# EAGLE design PPMB32-E (EAGLE 9.6.1)

## Sheet 1 of 2
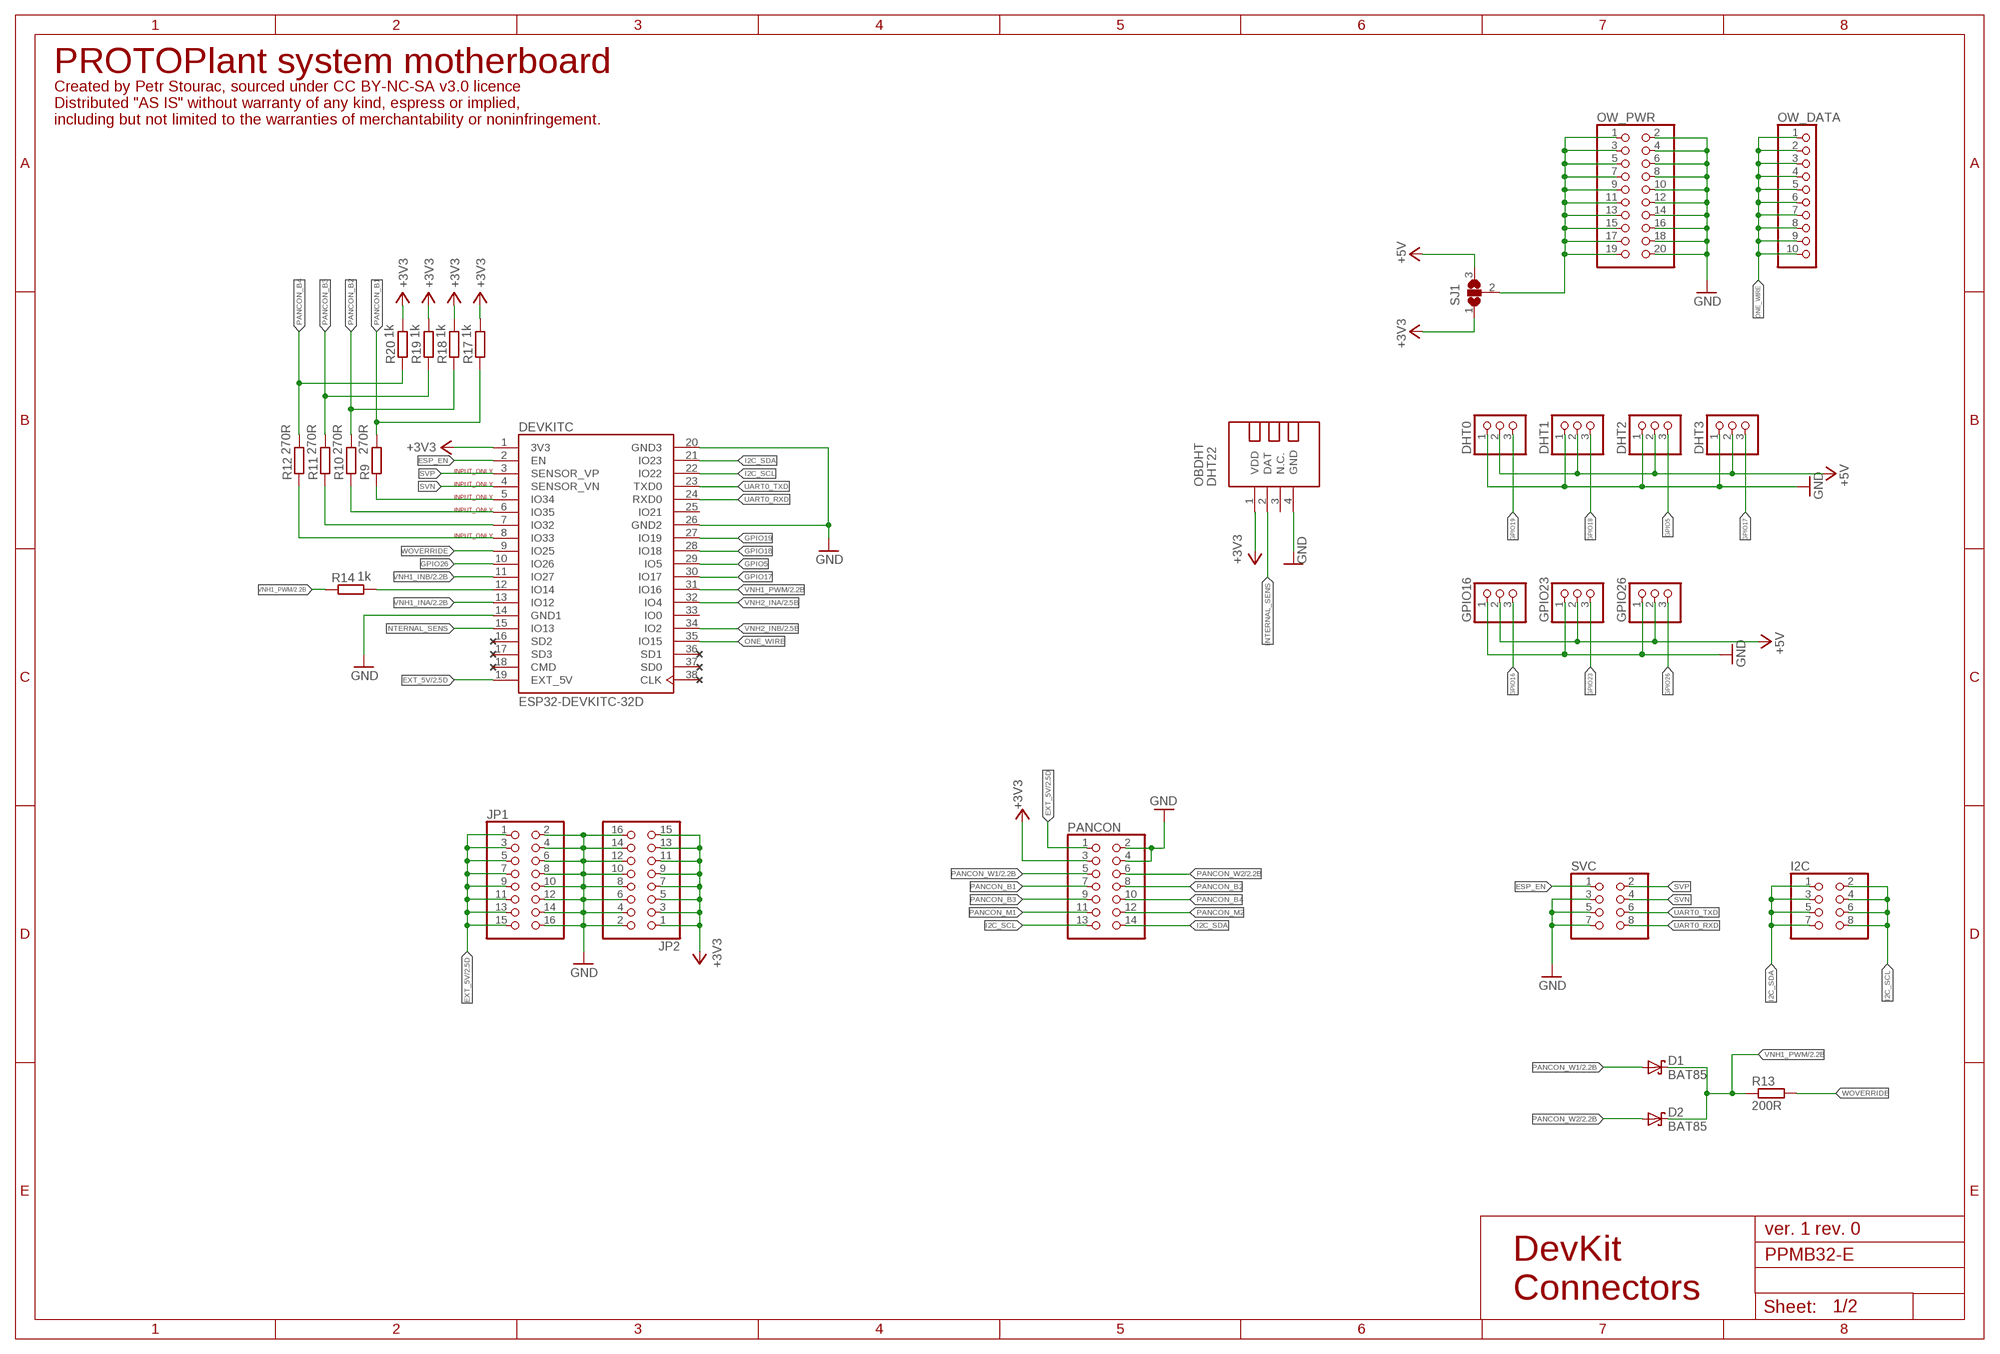
[diagram p0: schematic, sheet 1]

### Parts
D1  BAT85  SCHOTTKY-DIODEDO35-7  [DO35-7]
D2  BAT85  SCHOTTKY-DIODEDO35-7  [DO35-7]
DEVKITC  ESP32-DEVKITC-32D  [MODULE_ESP32-DEVKITC-32D]
DHT0  PINHD-1X3  [1X03]
DHT1  PINHD-1X3  [1X03]
DHT2  PINHD-1X3  [1X03]
DHT3  PINHD-1X3  [1X03]
GPIO16  PINHD-1X3  [1X03]
GPIO23  PINHD-1X3  [1X03]
GPIO26  PINHD-1X3  [1X03]
I2C  PINHD-2X4  [2X04]
JP1  PINHD-2X8  [2X08]
JP2  PINHD-2X8  [2X08]
OBDHT  DHT22  TEMP-HUM-SENSOR-DHT22  [TEMP-HUM-SENSOR-DHT22]
OW_DATA  PINHD-1X10  [1X10]
OW_PWR  PINHD-2X10  [2X10]
PANCON  PINHD-2X7  [2X07]
R9  270R  R-EU_R0603  [R0603]
R10  270R  R-EU_R0603  [R0603]
R11  270R  R-EU_R0603  [R0603]
R12  270R  R-EU_R0603  [R0603]
R13  200R  R-EU_R0603  [R0603]
R14  1k  R-EU_R0603  [R0603]
R17  1k  R-EU_R0603  [R0603]
R18  1k  R-EU_R0603  [R0603]
R19  1k  R-EU_R0603  [R0603]
R20  1k  R-EU_R0603  [R0603]
SJ1  SJ2W  [SJ_2]
SVC  PINHD-2X4  [2X04]

### Nets
+3V3: DEVKITC.1(3V3) JP2.1 JP2.3 JP2.5 JP2.7 JP2.9 JP2.11 JP2.13 JP2.15 OBDHT.1(VDD) PANCON.3 R17.2 R18.2 R19.2 R20.2 SJ1.1 ; also sheet 2
+5V: DHT0.2 DHT1.2 DHT2.2 DHT3.2 GPIO16.2 GPIO23.2 GPIO26.2 SJ1.3
ESP_EN: DEVKITC.2(EN) SVC.1
EXT_5V: DEVKITC.19(EXT_5V) JP1.1 JP1.3 JP1.5 JP1.7 JP1.9 JP1.11 JP1.13 JP1.15 PANCON.1 ; also sheet 2
GND: DEVKITC.14(GND1) DEVKITC.20(GND3) DEVKITC.26(GND2) DHT0.1 DHT1.1 DHT2.1 DHT3.1 GPIO16.1 GPIO23.1 GPIO26.1 JP1.2 JP1.4 JP1.6 JP1.8 JP1.10 JP1.12 JP1.14 JP1.16 JP2.2 JP2.4 JP2.6 JP2.8 JP2.10 JP2.12 JP2.14 JP2.16 OBDHT.4(GND) OW_PWR.2 OW_PWR.4 OW_PWR.6 OW_PWR.8 OW_PWR.10 OW_PWR.12 OW_PWR.14 OW_PWR.16 OW_PWR.18 OW_PWR.20 PANCON.2 PANCON.4 SVC.3 SVC.5 SVC.7 ; also sheet 2
GPIO5: DEVKITC.29(IO5) DHT2.3
GPIO16: GPIO16.3
GPIO17: DEVKITC.30(IO17) DHT3.3
GPIO18: DEVKITC.28(IO18) DHT1.3
GPIO19: DEVKITC.27(IO19) DHT0.3
GPIO23: GPIO23.3
GPIO26: DEVKITC.10(IO26) GPIO26.3
I2C_SCL: DEVKITC.22(IO22) I2C.2 I2C.4 I2C.6 I2C.8 PANCON.13
I2C_SDA: DEVKITC.21(IO23) I2C.1 I2C.3 I2C.5 I2C.7 PANCON.14
INTERNAL_SENS: DEVKITC.15(IO13) OBDHT.2(DAT)
N$4: DEVKITC.5(IO34) R9.1
N$8: DEVKITC.6(IO35) R10.1
N$9: DEVKITC.7(IO32) R11.1
N$10: DEVKITC.8(IO33) R12.1
N$11: OW_PWR.1 OW_PWR.3 OW_PWR.5 OW_PWR.7 OW_PWR.9 OW_PWR.11 OW_PWR.13 OW_PWR.15 OW_PWR.17 OW_PWR.19 SJ1.2
N$12: DEVKITC.12(IO14) R14.2
ONE_WIRE: DEVKITC.35(IO15) OW_DATA.1 OW_DATA.2 OW_DATA.3 OW_DATA.4 OW_DATA.5 OW_DATA.6 OW_DATA.7 OW_DATA.8 OW_DATA.9 OW_DATA.10
PANCON_B1: PANCON.7 R9.2 R17.1
PANCON_B2: PANCON.8 R10.2 R18.1
PANCON_B3: PANCON.9 R11.2 R19.1
PANCON_B4: PANCON.10 R12.2 R20.1
PANCON_M1: PANCON.11
PANCON_M2: PANCON.12
PANCON_W1: D1.A PANCON.5 ; also sheet 2
PANCON_W2: D2.A PANCON.6 ; also sheet 2
SVN: DEVKITC.4(SENSOR_VN) SVC.4
SVP: DEVKITC.3(SENSOR_VP) SVC.2
UART0_RXD: DEVKITC.24(RXD0) SVC.8
UART0_TXD: DEVKITC.23(TXD0) SVC.6
VNH1_INA: DEVKITC.13(IO12) ; also sheet 2
VNH1_INB: DEVKITC.11(IO27) ; also sheet 2
VNH1_PWM: D1.C D2.C DEVKITC.31(IO16) R13.1 R14.1 ; also sheet 2
VNH2_INA: DEVKITC.32(IO4) ; also sheet 2
VNH2_INB: DEVKITC.34(IO2) ; also sheet 2
WOVERRIDE: DEVKITC.9(IO25) R13.2
Unconnected: DEVKITC.16(SD2) DEVKITC.17(SD3) DEVKITC.18(CMD) DEVKITC.25(IO21) DEVKITC.33(IO0) DEVKITC.36(SD1) DEVKITC.37(SD0) DEVKITC.38(CLK) OBDHT.3(N.C.)

### Notes on the sheet
- PROTOPlant system motherboard
- Created by Petr Stourac, sourced under CC BY-NC-SA v3.0 licence
  Distributed "AS IS" without warranty of any kind, espress or implied, 
  including but not limited to the warranties of merchantability or noninfringement.
- INPUT_ONLY
- INPUT_ONLY
- INPUT_ONLY
- INPUT_ONLY
- INPUT_ONLY
- ver. 1 rev. 0
- DevKit
  Connectors

## Sheet 2 of 2
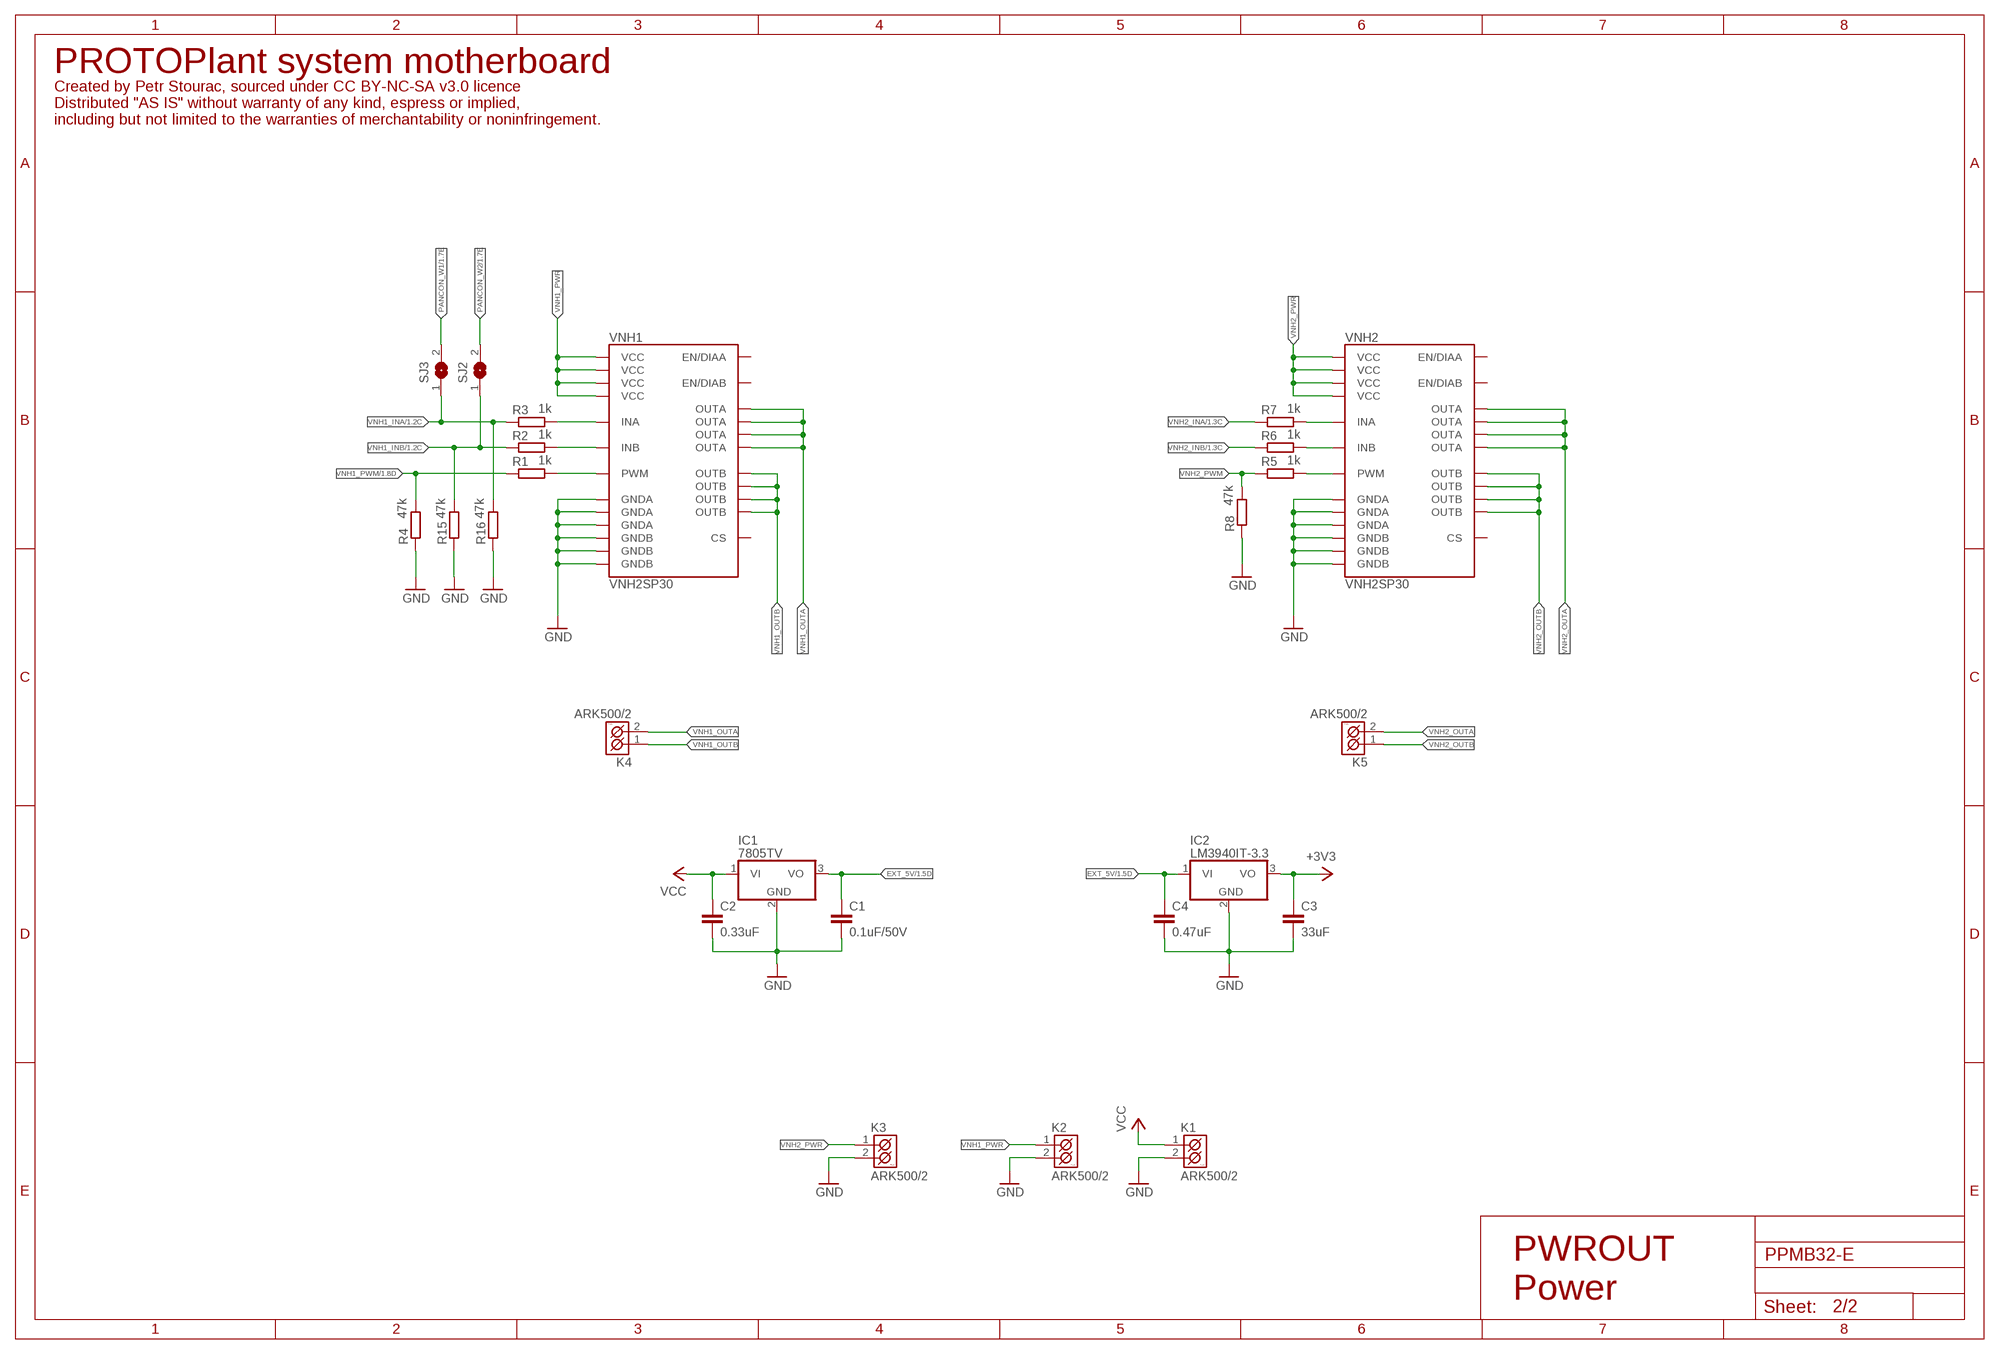
[diagram p1: schematic, sheet 2]

### Parts
C1  0.1uF/50V  C-EUC1206K  [C1206K]
C2  0.33uF  C-EUC1206K  [C1206K]
C3  33uF  C-EUC1206K  [C1206K]
C4  0.47uF  C-EUC1206K  [C1206K]
IC1  7805TV  [TO220V]
IC2  LM3940IT-3.3  788TV  [TO220V]
K1  ARK500/2  [ARK500/2]
K2  ARK500/2  [ARK500/2]
K3  ARK500/2  [ARK500/2]
K4  ARK500/2  [ARK500/2]
K5  ARK500/2  [ARK500/2]
R1  1k  R-EU_R0603  [R0603]
R2  1k  R-EU_R0603  [R0603]
R3  1k  R-EU_R0603  [R0603]
R4  47k  R-EU_R0603  [R0603]
R5  1k  R-EU_R0603  [R0603]
R6  1k  R-EU_R0603  [R0603]
R7  1k  R-EU_R0603  [R0603]
R8  47k  R-EU_R0603  [R0603]
R15  47k  R-EU_R0603  [R0603]
R16  47k  R-EU_R0603  [R0603]
SJ2  SJ  [SJ]
SJ3  SJ  [SJ]
VNH1  VNH2SP30  [VNH2SP30]
VNH2  VNH2SP30  [VNH2SP30]

### Nets
+3V3: C3.1 IC2.3(VO) ; also sheet 1
EXT_5V: C1.1 C4.1 IC1.3(VO) IC2.1(VI) ; also sheet 1
GND: C1.2 C2.2 C3.2 C4.2 IC1.2(GND) IC2.2(GND) K1.2(K2) K2.2(K2) K3.2(K2) R4.1 R8.1 R15.1 R16.1 VNH1.18(GNDB) VNH1.19(GNDB) VNH1.20(GNDB) VNH1.26(GNDA) VNH1.27(GNDA) VNH1.28(GNDA) VNH2.18(GNDB) VNH2.19(GNDB) VNH2.20(GNDB) VNH2.26(GNDA) VNH2.27(GNDA) VNH2.28(GNDA) ; also sheet 1
N$1: R3.2 VNH1.5(INA)
N$2: R2.2 VNH1.11(INB)
N$3: R1.2 VNH1.8(PWM)
N$5: R5.2 VNH2.8(PWM)
N$6: R6.2 VNH2.11(INB)
N$7: R7.2 VNH2.5(INA)
PANCON_W1: SJ3.2 ; also sheet 1
PANCON_W2: SJ2.2 ; also sheet 1
VCC: C2.1 IC1.1(VI) K1.1(K1)
VNH1_INA: R3.1 R16.2 SJ3.1 ; also sheet 1
VNH1_INB: R2.1 R15.2 SJ2.1 ; also sheet 1
VNH1_OUTA: K4.2(K2) VNH1.1(OUTA) VNH1.25(OUTA) VNH1.30(OUTA) VNH1.SLUG3(OUTA)
VNH1_OUTB: K4.1(K1) VNH1.15(OUTB) VNH1.16(OUTB) VNH1.21(OUTB) VNH1.SLUG2(OUTB)
VNH1_PWM: R1.1 R4.2 ; also sheet 1
VNH1_PWR: K2.1(K1) VNH1.3(VCC) VNH1.13(VCC) VNH1.23(VCC) VNH1.SLUG1(VCC)
VNH2_INA: R7.1 ; also sheet 1
VNH2_INB: R6.1 ; also sheet 1
VNH2_OUTA: K5.2(K2) VNH2.1(OUTA) VNH2.25(OUTA) VNH2.30(OUTA) VNH2.SLUG3(OUTA)
VNH2_OUTB: K5.1(K1) VNH2.15(OUTB) VNH2.16(OUTB) VNH2.21(OUTB) VNH2.SLUG2(OUTB)
VNH2_PWM: R5.1 R8.2
VNH2_PWR: K3.1(K1) VNH2.3(VCC) VNH2.13(VCC) VNH2.23(VCC) VNH2.SLUG1(VCC)
Unconnected: VNH1.6(EN/DIAA) VNH1.9(CS) VNH1.10(EN/DIAB) VNH2.6(EN/DIAA) VNH2.9(CS) VNH2.10(EN/DIAB)

### Notes on the sheet
- PROTOPlant system motherboard
- Created by Petr Stourac, sourced under CC BY-NC-SA v3.0 licence
  Distributed "AS IS" without warranty of any kind, espress or implied, 
  including but not limited to the warranties of merchantability or noninfringement.
- PWROUT
  Power

## Library data of the parts
C1-C4 = rcl:C-EU: CAPACITOR, European symbol; SPICEPREFIX: C
D1 D2 = adafruit:SCHOTTKY-DIODE: Schottky Diode
DEVKITC = ESP32-DEVKITC-32D:ESP32-DEVKITC-32D: Eval Board For Esp-Wroom-32; AVAILABILITY: Unavailable; DESCRIPTION: Eval Board For Esp-Wroom-32; MF: Espressif Systems; MP: ESP32-DEVKITC-32D; PACKAGE: None; PRICE: None
DHT0 DHT1-DHT3 GPIO16 GPIO23 GPIO26 = pinhead:PINHD-1X3: PIN HEADER
I2C SVC = pinhead:PINHD-2X4: PIN HEADER
IC1 IC2 = linear:78*: Positive VOLTAGE REGULATOR Source: http://cache.national.com/ds/LM/LM78L05.pdf http://www.fairchildsemi.com/ds/LM/LM7805.pdf
JP1 JP2 = pinhead:PINHD-2X8: PIN HEADER
K1-K5 = #PaJa_konektory:ARK500/2: Svorkovnice - roztec 5mm - dvojita
OBDHT = diy-modules:TEMP-HUM-SENSOR-DHT22: DHT22 - digital humidity & temperature sensor Also known as: AM2302 AM2302 datasheet available here: http://akizukidenshi.com/download/ds/aosong/AM2302.pdf Click here to find device on ebay.com <http://www.ebay.com/sch/dht22+digital+sensor>
OW_DATA = pinhead:PINHD-1X10: PIN HEADER
OW_PWR = pinhead:PINHD-2X10: PIN HEADER
PANCON = pinhead:PINHD-2X7: PIN HEADER
R1-R20 = rcl:R-EU_: RESISTOR, European symbol; SPICEPREFIX: R
SJ1 = jumper:SJ2W: SMD solder JUMPER
SJ2 SJ3 = jumper:SJ: SMD solder JUMPER
VNH1 VNH2 = SparkFun-IC-Special-Function:VNH2SP30: 30A motor driver IC(IC-10030,moster moto)

## Board
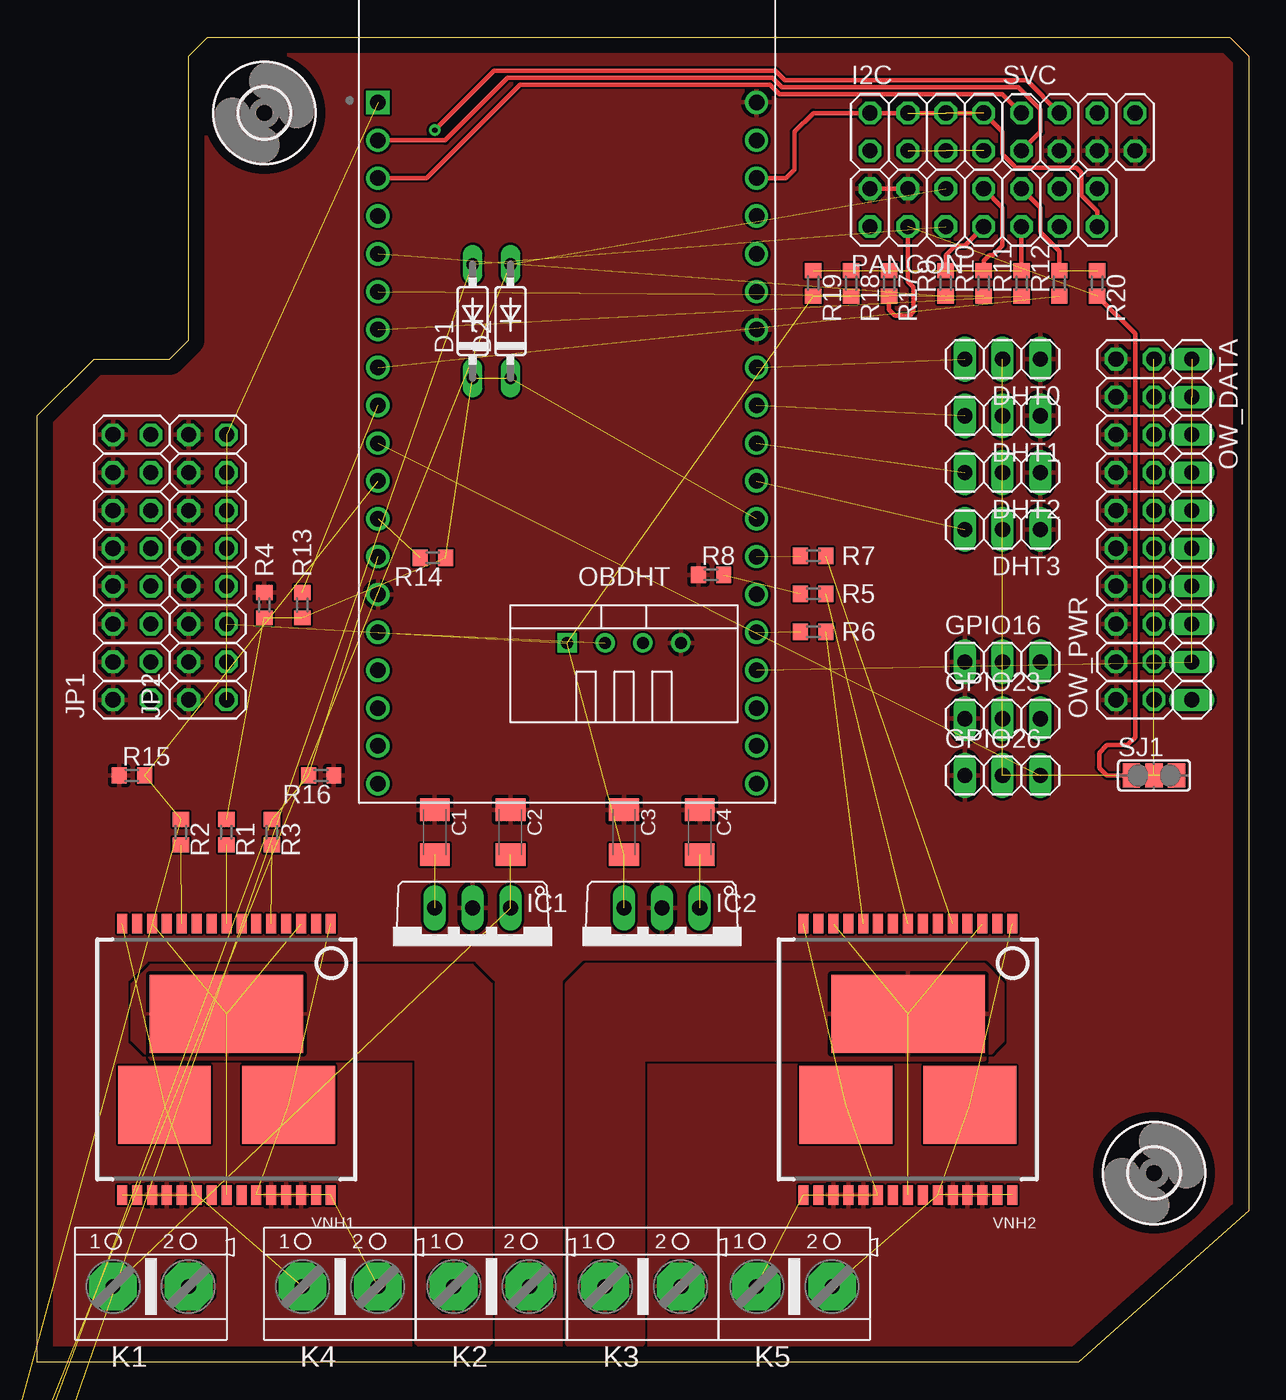
[diagram p2: board, top side]
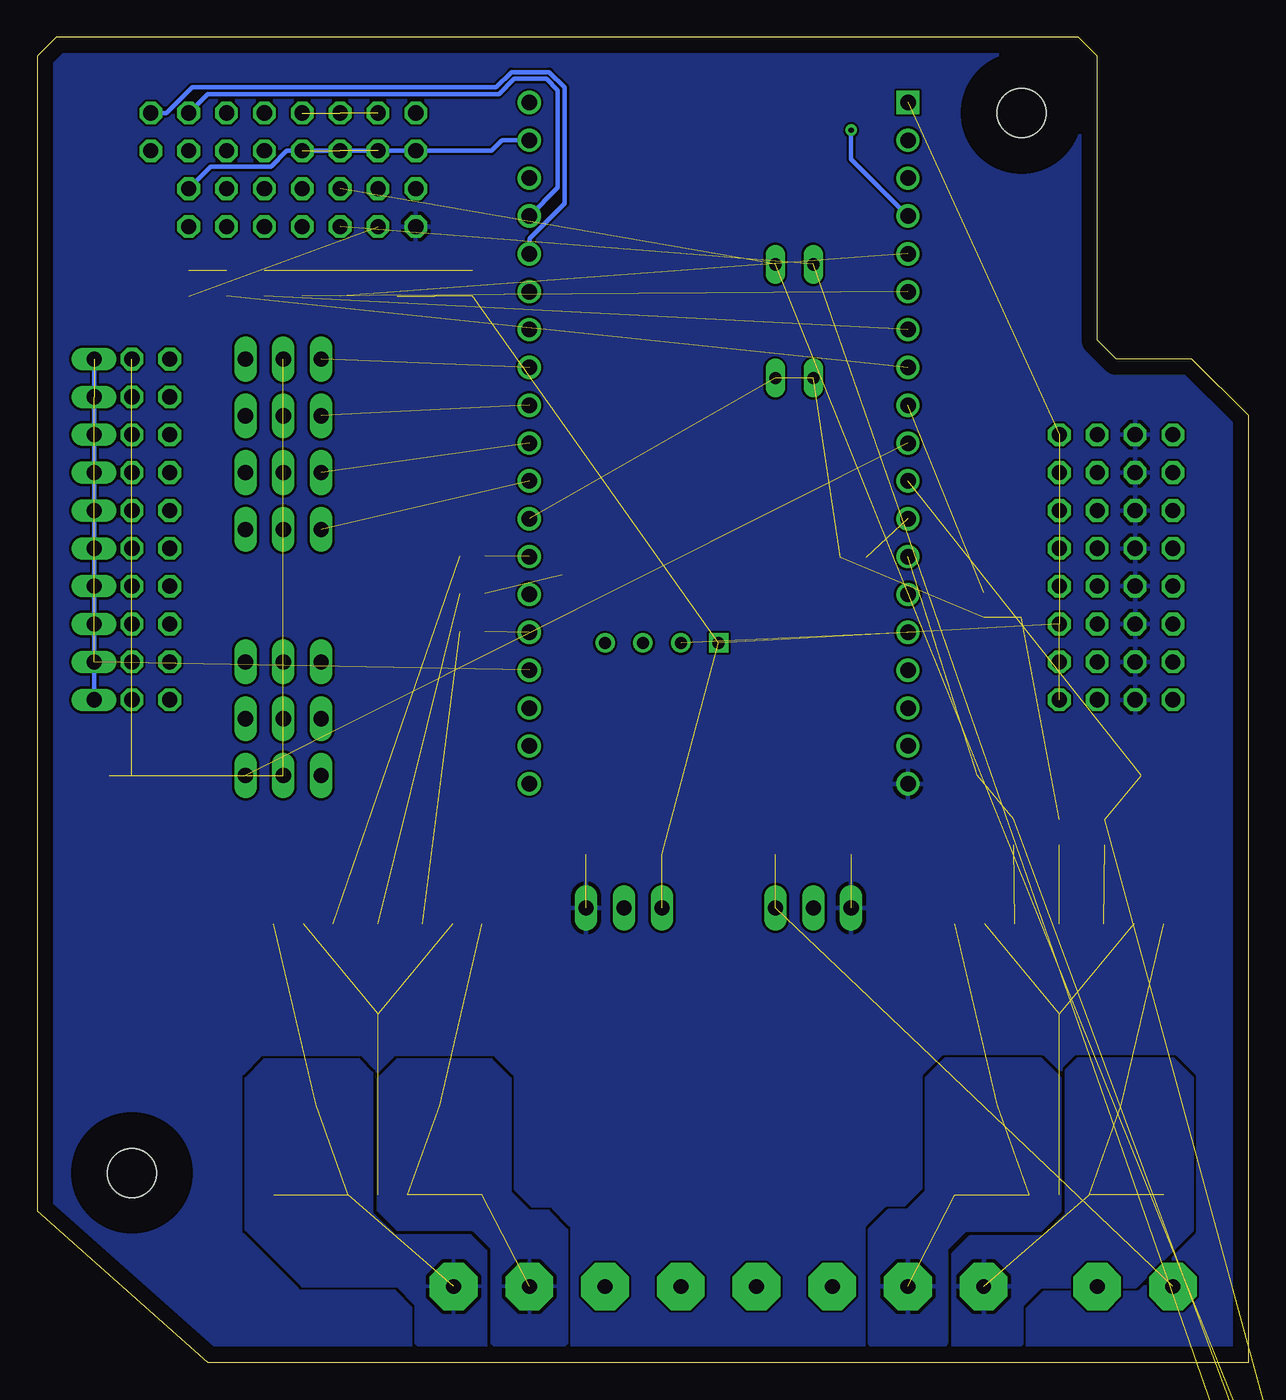
[diagram p3: board, bottom side, seen from below]

Size 81.28 x 88.9 mm. Coordinates in mm from the lower left corner, seen from the top.
Outline: 0,0 0,63.5 3.81,67.31 8.89,67.31 10.16,68.58 10.16,87.63 11.43,88.9 80.01,88.9 81.28,87.63 81.28,10.16 69.85,0 0,0
Copper layers (1*16): Top 0.035mm / dielectric 1.5mm / Bottom 0.035mm
Design rules "default *": minimum track width 12mil, minimum drill 0.35mm, track to track 6mil, track to pad 6mil, pad to pad 6mil, via to via 6mil, smd to smd 6mil, copper to edge 40mil, drill to drill 6mil, minimum pad ring 10mil, minimum via ring 8mil, stop-mask expansion 4mil, vias tented up to drill 0mil, thermal gap 10mil

### Footprints (pad centres in the part's own frame; a part is rotated, then mirrored left to right if it is on the bottom)
C1206K = smd 1.5 x 2: 1 -1.5,0; 2 1.5,0
DO35-7 = drill 0.813 long: A 3.81,0; C -3.81,0
MODULE_ESP32-DEVKITC-32D = drill 1.04 square: 1 -12.7,19.76 | drill 1.04: 2 -12.7,17.22; 3 -12.7,14.68; 4 -12.7,12.14; 5 -12.7,9.6; 6 -12.7,7.06; 7 -12.7,4.52; 8 -12.7,1.98; 9 -12.7,-0.56; 10 -12.7,-3.1; 11 -12.7,-5.64; 12 -12.7,-8.18; 13 -12.7,-10.72; 14 -12.7,-13.26; 15 -12.7,-15.8; 16 -12.7,-18.34; 17 -12.7,-20.88; 18 -12.7,-23.42; 19 -12.7,-25.96; 20 12.7,19.76; 21 12.7,17.22; 22 12.7,14.68; 23 12.7,12.14; 24 12.7,9.6; 25 12.7,7.06; 26 12.7,4.52; 27 12.7,1.98; 28 12.7,-0.56; 29 12.7,-3.1; 30 12.7,-5.64; 31 12.7,-8.18; 32 12.7,-10.72; 33 12.7,-13.26; 34 12.7,-15.8; 35 12.7,-18.34; 36 12.7,-20.88; 37 12.7,-23.42; 38 12.7,-25.96
1X03 = drill 1.016 long: 1 -2.54,0; 2 0,0; 3 2.54,0
2X04 = drill 1.016 octagon: 1 -3.81,-1.27; 2 -3.81,1.27; 3 -1.27,-1.27; 4 -1.27,1.27; 5 1.27,-1.27; 6 1.27,1.27; 7 3.81,-1.27; 8 3.81,1.27
TO220V = drill 1.016 long: 1 -2.54,-2.54; 2 0,-2.54; 3 2.54,-2.54
2X08 = drill 1.016 octagon: 1 -8.89,-1.27; 2 -8.89,1.27; 3 -6.35,-1.27; 4 -6.35,1.27; 5 -3.81,-1.27; 6 -3.81,1.27; 7 -1.27,-1.27; 8 -1.27,1.27; 9 1.27,-1.27; 10 1.27,1.27; 11 3.81,-1.27; 12 3.81,1.27; 13 6.35,-1.27; 14 6.35,1.27; 15 8.89,-1.27; 16 8.89,1.27
ARK500/2 = drill 1 pad 3.2 octagon: 1 -2.54,0; 2 2.54,0
TEMP-HUM-SENSOR-DHT22 = drill 0.8 square: 1 -3.81,0 | drill 0.8: 2 -1.27,0; 3 1.27,0; 4 3.81,0
1X10 = drill 1.016 long: 1 -11.43,0; 2 -8.89,0; 3 -6.35,0; 4 -3.81,0; 5 -1.27,0; 6 1.27,0; 7 3.81,0; 8 6.35,0; 9 8.89,0; 10 11.43,0
2X10 = drill 1.016 octagon: 1 -11.43,-1.27; 2 -11.43,1.27; 3 -8.89,-1.27; 4 -8.89,1.27; 5 -6.35,-1.27; 6 -6.35,1.27; 7 -3.81,-1.27; 8 -3.81,1.27; 9 -1.27,-1.27; 10 -1.27,1.27; 11 1.27,-1.27; 12 1.27,1.27; 13 3.81,-1.27; 14 3.81,1.27; 15 6.35,-1.27; 16 6.35,1.27; 17 8.89,-1.27; 18 8.89,1.27; 19 11.43,-1.27; 20 11.43,1.27
2X07 = drill 1.016 octagon: 1 -7.62,-1.27; 2 -7.62,1.27; 3 -5.08,-1.27; 4 -5.08,1.27; 5 -2.54,-1.27; 6 -2.54,1.27; 7 0,-1.27; 8 0,1.27; 9 2.54,-1.27; 10 2.54,1.27; 11 5.08,-1.27; 12 5.08,1.27; 13 7.62,-1.27; 14 7.62,1.27
R0603 = smd 1 x 1.1: 1 -0.85,0; 2 0.85,0
SJ_2 = smd 1.168 x 1.6: 1 -1.524,0; 2 0,0; 3 1.524,0
SJ = smd 1.168 x 1.6: 1 -0.762,0; 2 0.762,0
3,3 = hole 3.3: 0,0
VNH2SP30 = smd 0.67 x 1.3: 1 -7,-9.1; 2 -6,-9.1; 3 -5,-9.1; 4 -4,-9.1; 5 -3,-9.1; 6 -2,-9.1; 7 -1,-9.1; 8 0,-9.1; 9 1,-9.1; 10 2,-9.1; 11 3,-9.1; 12 4,-9.1; 13 5,-9.1; 14 6,-9.1; 15 7,-9.1; 16 7,9.1; 17 6,9.1; 18 5,9.1; 19 4,9.1; 20 3,9.1; 21 2,9.1; 22 1,9.1; 23 0,9.1; 24 -1,9.1; 25 -2,9.1; 26 -3,9.1; 27 -4,9.1; 28 -5,9.1; 29 -6,9.1; 30 -7,9.1 | smd 10.3 x 5.25: SLUG1 0,-3.05 | smd 6.23 x 5.25: SLUG2 4.165,3.05; SLUG3 -4.165,3.05

### Placement (x,y rotation side)
C1  26.67,35.56 90 top
C2  31.75,35.56 90 top
C3  39.37,35.56 90 top
C4  44.45,35.56 90 top
D1  29.21,69.85 90 top
D2  31.75,69.85 90 top
DEVKITC  35.56,64.77 0 top
DHT0  64.77,67.31 180 top
DHT1  64.77,63.5 180 top
DHT2  64.77,59.69 180 top
DHT3  64.77,55.88 180 top
GPIO16  64.77,46.99 0 top
GPIO23  64.77,43.18 0 top
GPIO26  64.77,39.37 0 top
I2C  59.69,82.55 0 top
IC1  29.21,27.94 180 top
IC2  41.91,27.94 180 top
JP1  6.35,53.34 90 top
JP2  11.43,53.34 90 top
K1  7.62,5.08 0 top
K2  30.48,5.08 0 top
K3  40.64,5.08 0 top
K4  20.32,5.08 0 top
K5  50.8,5.08 0 top
OBDHT  39.37,48.26 0 top
OW_DATA  77.47,55.88 270 top
OW_PWR  73.66,55.88 90 top
PANCON  63.5,77.47 0 top
R1  12.7,35.56 270 top
R2  9.65,35.56 270 top
R3  15.75,35.56 270 top
R4  15.24,50.8 270 top
R5  52.07,51.56 0 top
R6  52.07,49.02 0 top
R7  52.07,54.1 0 top
R8  45.21,52.83 0 top
R9  60.96,72.39 90 top
R10  63.5,72.39 90 top
R11  66.04,72.39 90 top
R12  68.58,72.39 90 top
R13  17.78,50.8 90 top
R14  26.54,53.98 180 top
R15  6.35,39.37 0 top
R16  19.05,39.37 180 top
R17  57.15,72.39 270 top
R18  54.61,72.39 270 top
R19  52.07,72.39 270 top
R20  71.12,72.39 270 top
SJ1  74.93,39.37 0 top
SJ2  -1.27,-6.35 0 top  (outside the outline)
SJ3  -1.27,-11.43 0 top  (outside the outline)
SVC  69.85,82.55 0 top
U$7  [3,3]  15.24,83.82 0 top
U$8  [3,3]  74.93,12.7 0 top
VNH1  12.7,20.32 180 top
VNH2  58.42,20.32 180 top

### Tracks (layer width: path | path; a pad name or v marks a point on that pad's centre or on a via)
+3V3  (15 unrouted)
  Top 0.305: R17.2 57.15,70.61 57.53,70.23 58.55,70.23 58.8,70.48 58.8,72.14 58.42,72.52 PANCON.3 | R20.2 73.66,69 73.66,41.91 73.15,41.4 71.75,41.4 71.25,40.89 71.25,39.88 71.75,39.37 SJ1.1
+5V  (7 unrouted)
ESP_EN
  Top 0.305: SVC.1 67.31,82.55 67.31,84.06 65.82,85.55 49.97,85.55 49.34,86.18 46.99,86.18 46.86,86.18 31.57,86.18 27.38,81.99 DEVKITC.2
EXT_5V  (2 unrouted)
  pour Bottom (rank 6): -3.81,90.17 83.82,90.17 83.82,-2.54 -3.81,-2.54
GND
  Top 0.305: PANCON.4 PANCON.2
  pour Top (rank 3): 45.72,1.27 44.45,0 26.67,0 25.4,1.27 25.4,8.89 24.13,10.16 3.81,10.16 2.54,11.43 2.54,29.21 3.81,30.48 21.59,30.48 22.86,29.21 48.26,29.21 49.53,30.48 67.31,30.48 68.58,29.21 68.58,11.43 67.31,10.16 46.99,10.16 45.72,8.89
  pour Top (rank 3): -2.54,-1.27 82.55,-1.27 82.55,88.9 -2.54,88.9
GPIO5  (1 unrouted)
GPIO17  (1 unrouted)
GPIO18  (1 unrouted)
GPIO19  (1 unrouted)
GPIO26  (1 unrouted)
I2C_SCL  (2 unrouted)
  Top 0.305: DEVKITC.22 50.24,79.45 50.8,80.01 50.8,82.55 52.07,83.82 I2C.2 I2C.8 64.77,82.55 64.77,81.04 65.67,80.14 69.72,80.14 70.05,79.81 70.05,78.3 71.12,77.23 PANCON.13
I2C_SDA  (2 unrouted)
  Bottom 0.305: DEVKITC.21 50.09,81.99 50.8,81.28 I2C.1 I2C.7 64.53,81.28 65.6,80.21 69.65,80.21 PANCON.14
INTERNAL_SENS  (1 unrouted)
N$1  (1 unrouted)
N$2  (1 unrouted)
N$3  (1 unrouted)
N$4  (1 unrouted)
N$5  (1 unrouted)
N$6  (1 unrouted)
N$7  (1 unrouted)
N$8  (1 unrouted)
N$9  (1 unrouted)
N$10  (1 unrouted)
N$11  (10 unrouted)
N$12  (1 unrouted)
ONE_WIRE  (9 unrouted)
  Bottom 0.305: OW_DATA.1 OW_DATA.10
PANCON_B1  (1 unrouted)
  Top 0.305: PANCON.7 62.23,74.93 61.59,74.93 60.96,74.3 R9.2
PANCON_B2  (1 unrouted)
  Top 0.305: PANCON.8 64.77,77.47 64.77,74.93 64.14,74.3 63.88,74.3 63.5,73.91 R10.2
PANCON_B3  (1 unrouted)
  Top 0.305: PANCON.9 R11.2
PANCON_B4  (1 unrouted)
  Top 0.305: PANCON.10 67.31,77.47 67.31,75.82 68.58,74.55 R12.2
PANCON_W1  (2 unrouted)
PANCON_W2  (2 unrouted)
SVN  (via drill 0.35)
  Top 0.305: SVC.4 66.4,86 50.16,86 49.53,86.64 30.64,86.64 v26.67,82.67
  Bottom 0.305: v26.67,82.67 26.67,80.72 DEVKITC.4
SVP
  Top 0.305: SVC.2 64.77,85.09 49.78,85.09 49.15,85.72 46.99,85.72 46.86,85.72 32.38,85.72 26.11,79.45 DEVKITC.3
UART0_RXD
  Bottom 0.305: SVC.8 72.63,83.82 70.9,85.55 50.48,85.55 49.47,86.56 46.93,86.56 45.9,85.53 45.9,77.74 48.26,75.38 DEVKITC.24
UART0_TXD
  Bottom 0.305: SVC.6 69.85,85.09 50.29,85.09 49.28,86.11 47.12,86.11 46.35,85.34 46.35,78.81 DEVKITC.23
VCC  (2 unrouted)
VNH1_INA  (3 unrouted)
VNH1_INB  (3 unrouted)
VNH1_OUTA  (4 unrouted)
  pour Bottom (rank 2): 25.4,1.27 24.13,0 21.59,0 20.32,1.27 20.32,7.62 19.05,8.89 13.97,8.89 12.7,10.16 12.7,19.05 13.97,20.32 20.32,20.32 21.59,19.05 21.59,11.43 22.86,10.16 24.13,10.16 25.4,8.89
VNH1_OUTB  (4 unrouted)
  pour Bottom (rank 2): 19.81,0.76 19.05,0 16.51,0 15.24,1.27 15.24,3.81 13.97,5.08 7.62,5.08 3.81,8.89 3.81,19.05 5.08,20.32 11.43,20.32 12.19,19.56 12.19,9.91 13.72,8.38 18.67,8.38 19.81,7.24
VNH1_PWM  (6 unrouted)
VNH1_PWR  (3 unrouted)
  pour Top (rank 2): 30.48,25.4 30.48,1.27 29.21,0 26.67,0 25.4,1.27 25.4,20.32 7.62,20.32 6.35,21.59 6.35,25.4 7.62,26.67 29.21,26.67
  pour Bottom (rank 3): 4.83,20.7 3.43,19.3 3.43,8.64 7.49,4.57 13.84,4.57 14.73,3.68 14.73,-0.51 13.97,-1.27 -1.27,-1.27 -1.27,27.94 30.48,27.94 31.75,26.67 31.75,8.89 30.48,7.62 25.91,7.62 25.91,8.89 24.26,10.54 23.11,10.54 21.97,11.68 21.97,19.18 20.45,20.7
VNH2_INA  (1 unrouted)
VNH2_INB  (1 unrouted)
VNH2_OUTA  (4 unrouted)
  pour Bottom (rank 2): 51.18,0.89 51.18,7.49 52.2,8.51 57.28,8.51 58.8,10.03 58.8,19.43 59.69,20.32 66.04,20.32 67.31,19.05 67.31,8.89 63.5,5.08 57.15,5.08 55.88,3.81 55.88,1.27 54.61,0 52.07,0
VNH2_OUTB  (4 unrouted)
  pour Bottom (rank 2): 45.72,1.27 46.99,0 49.53,0 50.8,1.27 50.8,7.62 52.07,8.89 57.15,8.89 58.42,10.16 58.42,19.05 57.15,20.32 50.8,20.32 49.53,19.05 49.53,11.43 48.26,10.16 46.99,10.16 45.72,8.89
VNH2_PWM  (1 unrouted)
VNH2_PWR  (3 unrouted)
  pour Top (rank 2): 35.56,1.27 36.83,0 39.37,0 40.64,1.27 40.64,20.32 63.5,20.32 64.77,21.59 64.77,25.4 63.5,26.67 36.83,26.67 35.56,25.4
  pour Bottom: 82.55,27.94 36.83,27.94 35.56,26.67 35.56,8.89 36.83,7.62 45.72,7.62 45.72,8.89 46.99,10.16 48.26,10.16 49.53,11.43 49.53,19.05 50.8,20.32 66.04,20.32 67.31,19.05 67.31,8.89 63.5,5.08 57.15,5.08 55.88,3.81 55.88,0 57.15,-1.27 81.28,-1.27 82.55,0
WOVERRIDE  (1 unrouted)